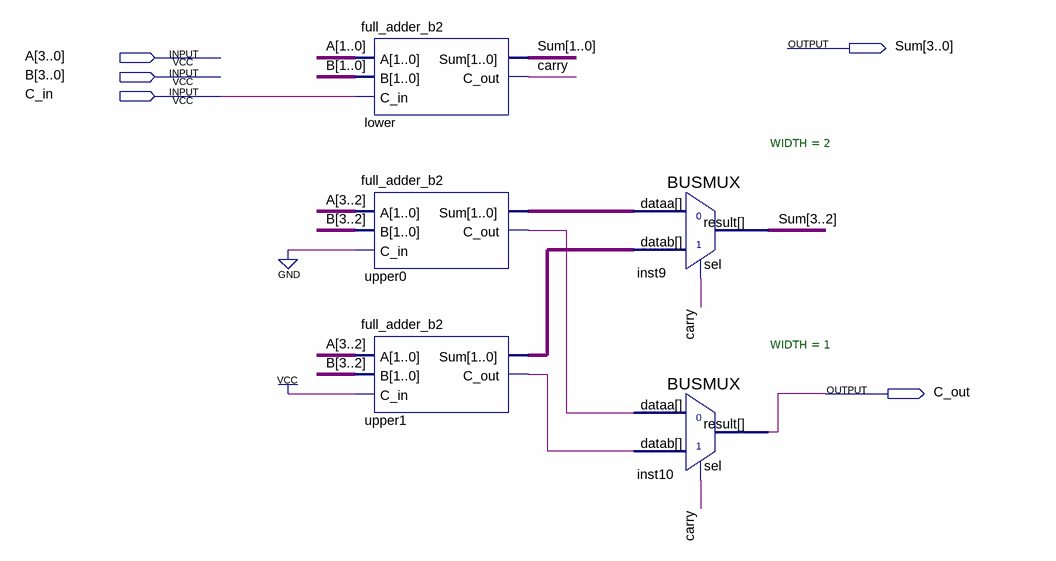
[diagram p0: schematic sheet]
// Quartus schematic full_adder_b4.bdf as structural Verilog: 5 symbols, 5 pins
module full_adder_b4 (
  input  [3:0] A,
  input  [3:0] B,
  input  C_in,
  output [3:0] Sum,
  output C_out
);

  wire carry, upper0_c_out, upper1_c_out;
  wire [1:0] upper0_sum, upper1_sum;

  full_adder_b2 lower (.A(A[1:0]), .B(B[1:0]), .C_in(C_in), .Sum(Sum[1:0]), .C_out(carry));
  full_adder_b2 upper0 (.A(A[3:2]), .B(B[3:2]), .C_in(1'b0), .Sum(upper0_sum), .C_out(upper0_c_out));
  full_adder_b2 upper1 (.A(A[3:2]), .B(B[3:2]), .C_in(1'b1), .Sum(upper1_sum), .C_out(upper1_c_out));
  BUSMUX #(.WIDTH(2)) inst9 (.datab(upper1_sum), .sel(carry), .dataa(upper0_sum), .result(Sum[3:2]));
  BUSMUX #(.WIDTH(1)) inst10 (.datab(upper1_c_out), .sel(carry), .dataa(upper0_c_out), .result(C_out));
endmodule
